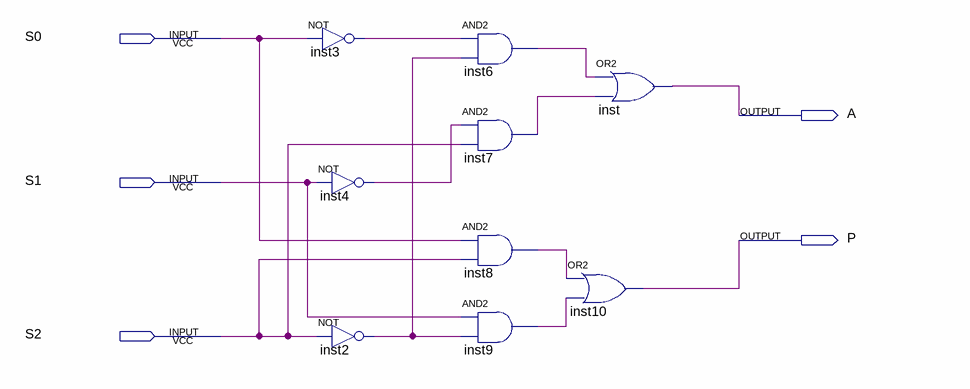
[diagram p0: schematic sheet]
// Quartus schematic lab5.1.bdf as structural Verilog: 9 symbols, 5 pins
module \lab5.1  (
  input  S0,
  input  S1,
  input  S2,
  output A,
  output P
);

  wire inst2_out, inst3_out, inst4_out, inst6_out, inst7_out, inst8_out, inst9_out;

  not inst3 (inst3_out, S0);
  not inst4 (inst4_out, S1);
  not inst2 (inst2_out, S2);
  and inst6 (inst6_out, inst3_out, inst2_out);
  and inst7 (inst7_out, inst4_out, S2);
  and inst8 (inst8_out, S0, S2);
  and inst9 (inst9_out, S1, inst2_out);
  or inst (A, inst6_out, inst7_out);
  or inst10 (P, inst8_out, inst9_out);
endmodule
